# Altium schematic sheet 5_Inertial_Measurement_RTC.SchDoc
size A3; Organization: Altium Limited; Address1: L3, 12a Rodborough Rd; Address2: Frenchs Forest; Address3: NSW; Address4: Australia 2086; SheetNumber: 5; SheetTotal: 7
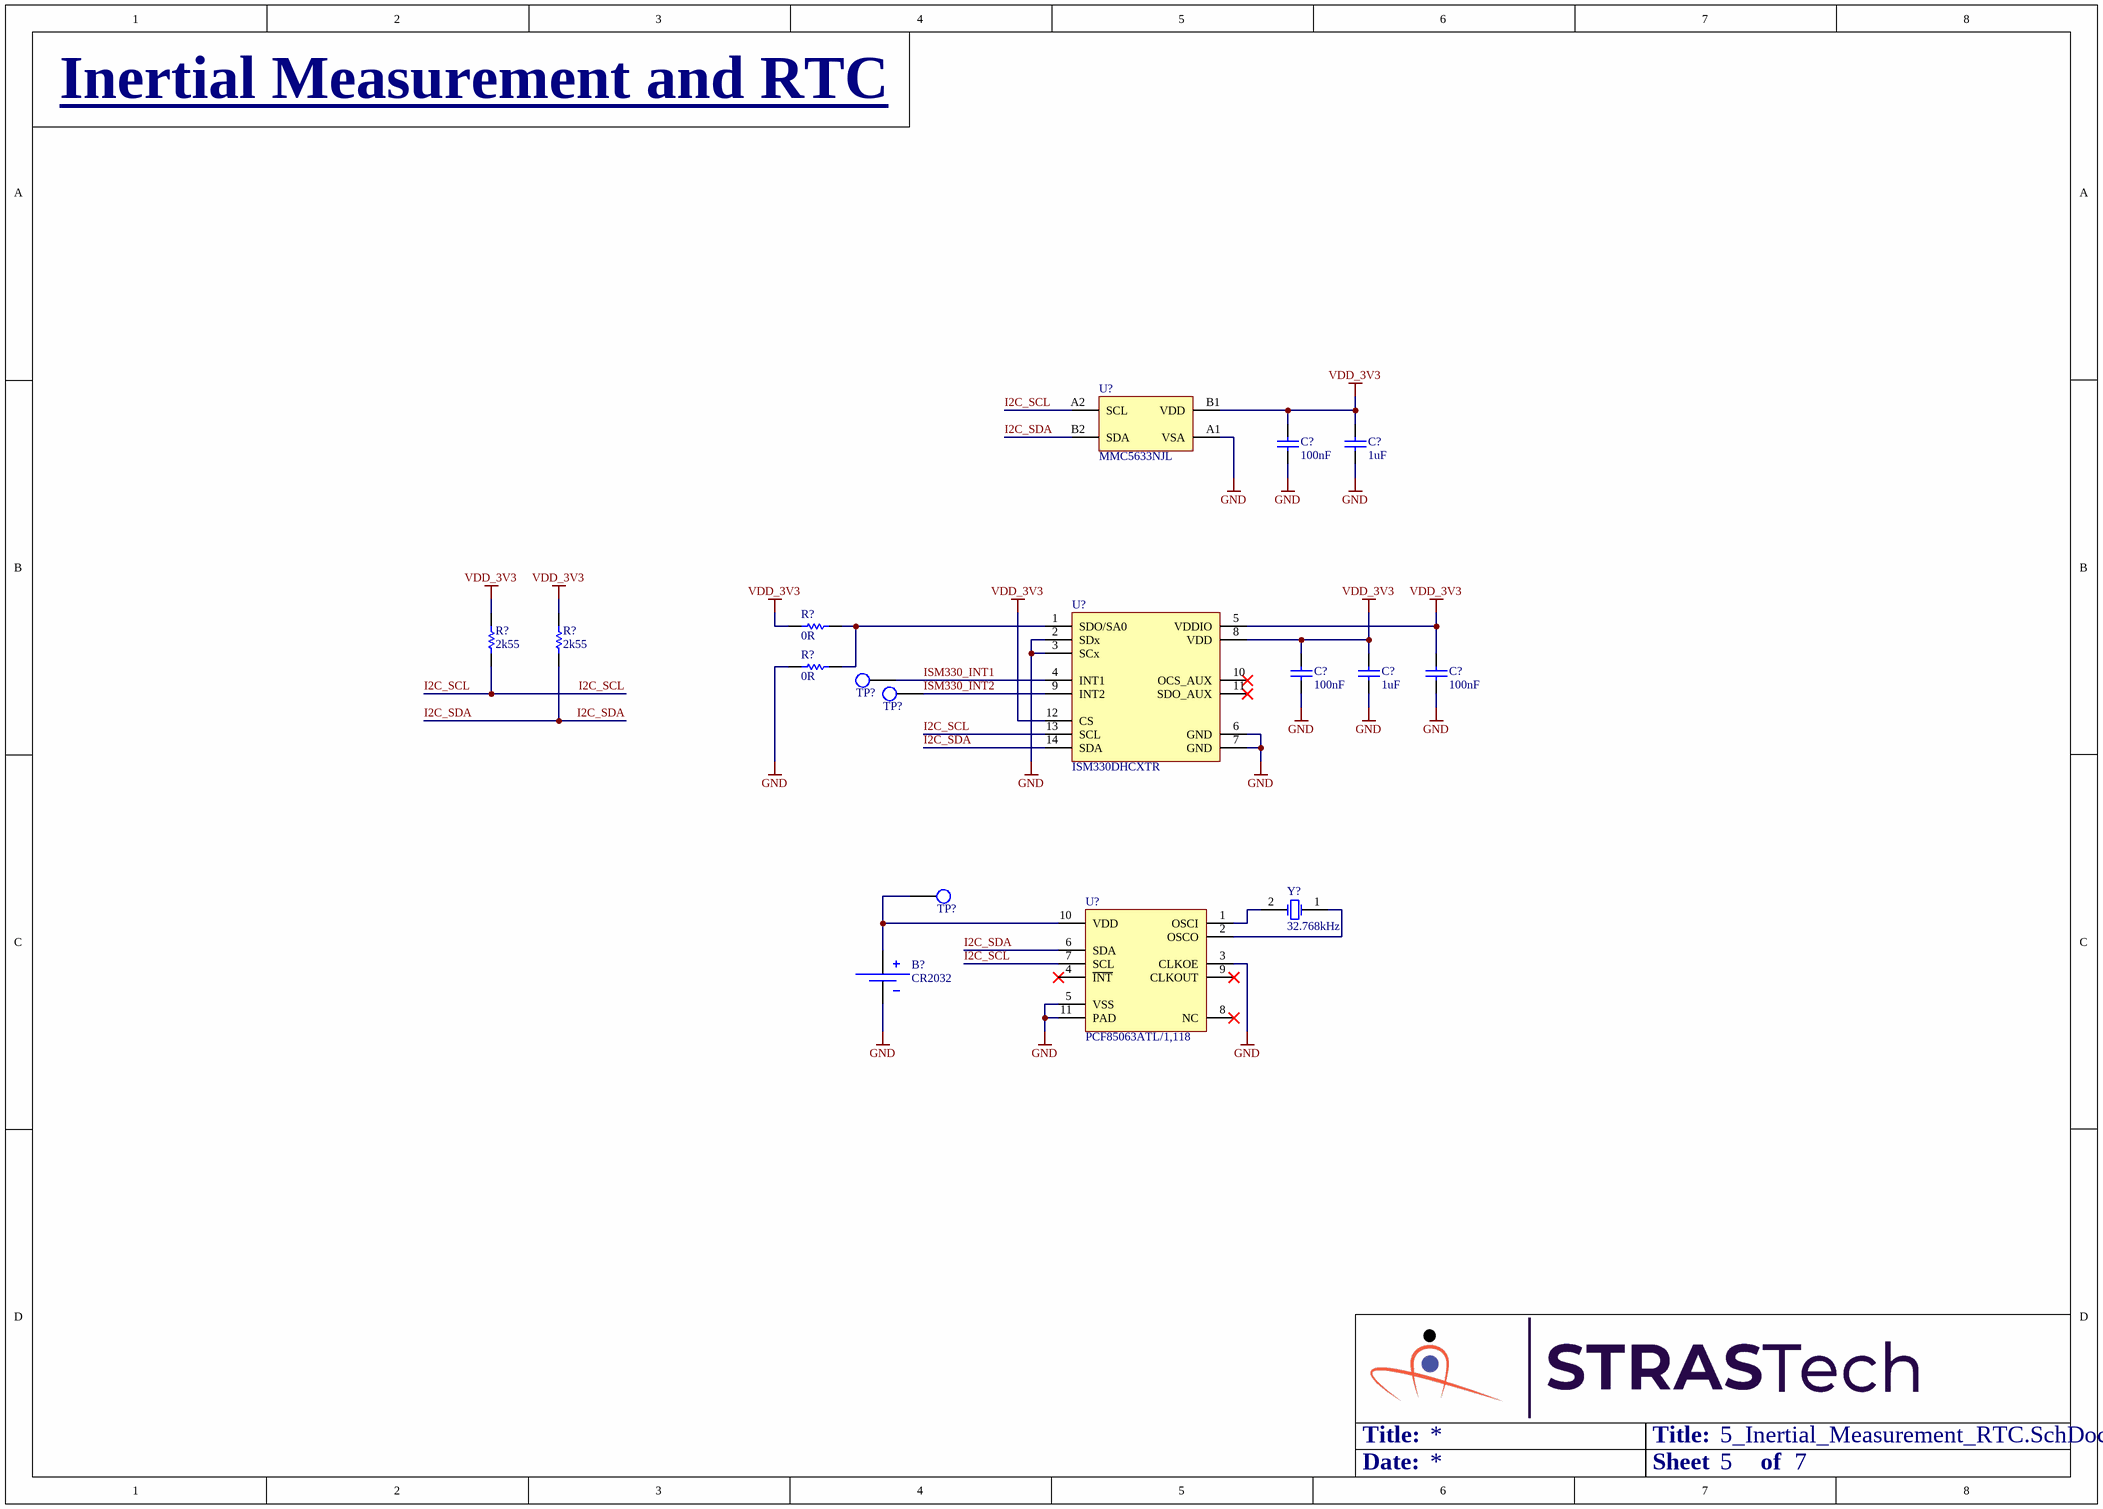
[diagram p0: 5_Inertial_Measurement_RTC.SchDoc]

## Parts
(Parts that share a designator on the sheet are numbered #1, #2 ... from top to bottom, then left to right.)
B?  CR2032  [Holder,Cell,CR2032,PCB,SMD]
C?#1  100nF  [Cap,SMD,0402]
C?#2  1uF  [Cap,SMD,0402]
C?#3  100nF  [Cap,SMD,0402]
C?#4  1uF  [Cap,SMD,0402]
C?#5  100nF  [Cap,SMD,0402]
R?#1  0R  [RES,0402]
R?#2  2k55  [RES,0402]
R?#3  2k55  [RES,0402]
R?#4  0R  [RES,0402]
TP?#1  TESTPOINT  [testpoint,smd,round,1mm]  (value not drawn)
TP?#2  TESTPOINT  [testpoint,smd,round,1mm]  (value not drawn)
TP?#3  TESTPOINT  [testpoint,smd,round,1mm]  (value not drawn)
U?#1  MMC5633NJL  [IC,WLP,2x2,P0.4mm]
U?#2  ISM330DHCXTR  [IC,LGA-14L,2.5x3mm]
U?#3  PCF85063ATL/1,118  [IC,DFN-10_3x3,P0.5mm]
Y?  32.768kHz  [XTAL,SMD,2PIN,2.0x1.2MM]

## Nets
GND: B?.2(BATT_N) C?#1.2 C?#2.1 C?#3.1 C?#4.1 C?#5.1 R?#4.1 U?#1.A1(VSA) U?#2.2(SDx) U?#2.3(SCx) U?#2.6(GND) U?#2.7(GND) U?#3.3(CLKOE) U?#3.5(VSS) U?#3.11(PAD)
VDD_3V3: C?#1.1 C?#2.2 C?#3.2 C?#4.2 C?#5.2 R?#1.1 R?#2.2 R?#3.2 U?#1.B1(VDD) U?#2.5(VDDIO) U?#2.8(VDD) U?#2.12(CS)
I2C_SCL: R?#2.1 U?#1.A2(SCL) U?#2.13(SCL) U?#3.7(SCL)
I2C_SDA: R?#3.1 U?#1.B2(SDA) U?#2.14(SDA) U?#3.6(SDA)
ISM330_INT1: TP?#1.1(TP) U?#2.4(INT1)
ISM330_INT2: TP?#2.1(TP) U?#2.9(INT2)
NetB?_1: B?.1(BATT_P) TP?#3.1(TP) U?#3.10(VDD)
NetR?#1_2: R?#1.2 R?#4.2 U?#2.1(SDO/SA0)
NetU?#3_1: U?#3.1(OSCI) Y?.2(GND)
NetU?#3_2: U?#3.2(OSCO) Y?.1(OSC1)

Not connected (* = marked no-connect by the designer): U?#2 10(OCS_AUX)* 11(SDO_AUX)*; U?#3 4(~{INT})* 8(NC)* 9(CLKOUT)*

## Notes on the sheet
- Inertial Measurement and RTC
- Title:
- Date:
- Sheet
- of
- Title
- Size:
- A3
- Revision:
- Design By:

## Library data of the parts
B? = Holder,Cell,CR2032,PCB,SMD: Battery Retainer Coin, 20.0mm 1 Cell SMD (SMT) Tab; Manufacturer: Keystone Electronics; Manufacturer Part Number: 3034; Vendor Part Number: 36-3034-ND; Vendor: Digikey; CreatedBy: Judd Foster; HelpURL: https://www.keyelco.com/userAssets/file/M65p9.pdf
C?#1 C?#3 C?#5 = CAP,Cer,100nF,25VDC,X7R,0402: 0.1µF ±10% 25V Ceramic Capacitor X7R 0402 (1005 Metric); Vendor Part Number: 490-14603-1-ND; Manufacturer: Murata Electronics; Manufacturer Part Number: GRM155R71E104KE14J; Vendor: Digikey; HelpURL: https://search.murata.co.jp/Ceramy/image/img/A01X/G101/ENG/GRM155R71E104KE14-01.pdf; CreatedBy: Judd Foster
C?#2 C?#4 = CAP,Cer,1uF,35VDC,X5R,0402: 1 µF ±10% 35V Ceramic Capacitor X5R 0402 (1005 Metric); Vendor Part Number: 445-9073-1-ND; Manufacturer: TDK Corporation; Manufacturer Part Number: C1005X5R1V105K050BC; Vendor: Digikey; HelpURL: https://product.tdk.com/info/en/catalog/datasheets/mlcc_commercial_general_en.pdf?ref_disty=digikey; CreatedBy: Judd Foster
R?#1 R?#4 = RES,0R0,0.1W,0402: 0 Ohms Jumper 0.1W, 1/10W Chip Resistor 0402 (1005 Metric) Automotive AEC-Q200 Thick Film; Manufacturer: Panasonic Electronic Components; Manufacturer Part Number: ERJ-2GE0R00X; Vendor Part Number: P0.0JCT-ND; Vendor: Digikey; CreatedBy: Judd Foster; HelpURL: https://industrial.panasonic.com/cdbs/www-data/pdf/RDA0000/AOA0000C301.pdf
R?#2 R?#3 = RES,2k55,1%,0.063W,0402: 2.55 kOhms ±1% 0.063W, 1/16W Chip Resistor 0402 (1005 Metric) Automotive AEC-Q200 Thick Film; Manufacturer: Stackpole Electronics Inc; Manufacturer Part Number: RMCF0402FT2K55; Vendor Part Number: RMCF0402FT2K55CT-ND; Vendor: Digikey; CreatedBy: Judd Foster; HelpURL: https://www.seielect.com/catalog/sei-rmcf_rmcp.pdf
TP?#1-TP?#3 = TESTPOINT: PCB Testpoint; CreatedBy: Judd Foster; HelpURL: N/A; Manufacturer: N/A; Manufacturer Part Number: N/A; Vendor: N/A; Vendor Part Number: N/A
U?#1 = MMC5633NJL: Magnetoresistive Sensor X, Y, Z Axis 4-WLP (0.85x0.85); Manufacturer: Memsic Inc.; Vendor Part Number: 1267-MMC5633NJLCT-ND; Vendor: Digikey; CreatedBy: Judd Foster; HelpURL: https://media.digikey.com/pdf/Data%20Sheets/MEMSIC%20PDFs/MMC5633NJL_RevA_3-12-20.pdf; Manufacturer Part Number: MMC5633NJL
U?#2 = ISM330DHCXTR: Accelerometer, Gyroscope, Temperature, 6 Axis Sensor I²C, SPI Output; Manufacturer: STMicroelectronics; Vendor Part Number: 497-19784-1-ND; Vendor: Digikey; CreatedBy: Judd Foster; HelpURL: https://www.st.com/resource/en/datasheet/ism330dhcx.pdf; Manufacturer Part Number: ISM330DHCXTR
U?#3 = PCF85063ATL/1,118: Real Time Clock (RTC) IC Clock/Calendar - I²C, 2-Wire Serial 10-XFDFN Exposed Pad; Manufacturer: NXP USA Inc.; Vendor Part Number: 568-10235-1-ND; Vendor: Digikey; CreatedBy: Judd Foster; HelpURL: https://www.nxp.com/docs/en/data-sheet/PCF85063A.pdf; Manufacturer Part Number: PCF85063ATL/1,118
Y? = XTAL,32.768kHz,9pF,SMD: 32.768 kHz ±20ppm Crystal 9pF 70 kOhms 2-SMD, No Lead; Manufacturer: Micro Crystal AG; Manufacturer Part Number: CM8V-T1A-32.768KHZ-9PF-20PPM-TA-QC; Vendor Part Number: 2195-CM8V-T1A-32.768KHZ-9PF-20PPM-TA-QCCT-ND; Vendor: Digikey; CreatedBy: Judd Foster; HelpURL: https://www.microcrystal.com/fileadmin/Media/Products/32kHz/Datasheet/CM8V-T1A.pdf